# EAGLE design Occulow-Control (EAGLE 8.0.2)

## Sheet 1 of 4
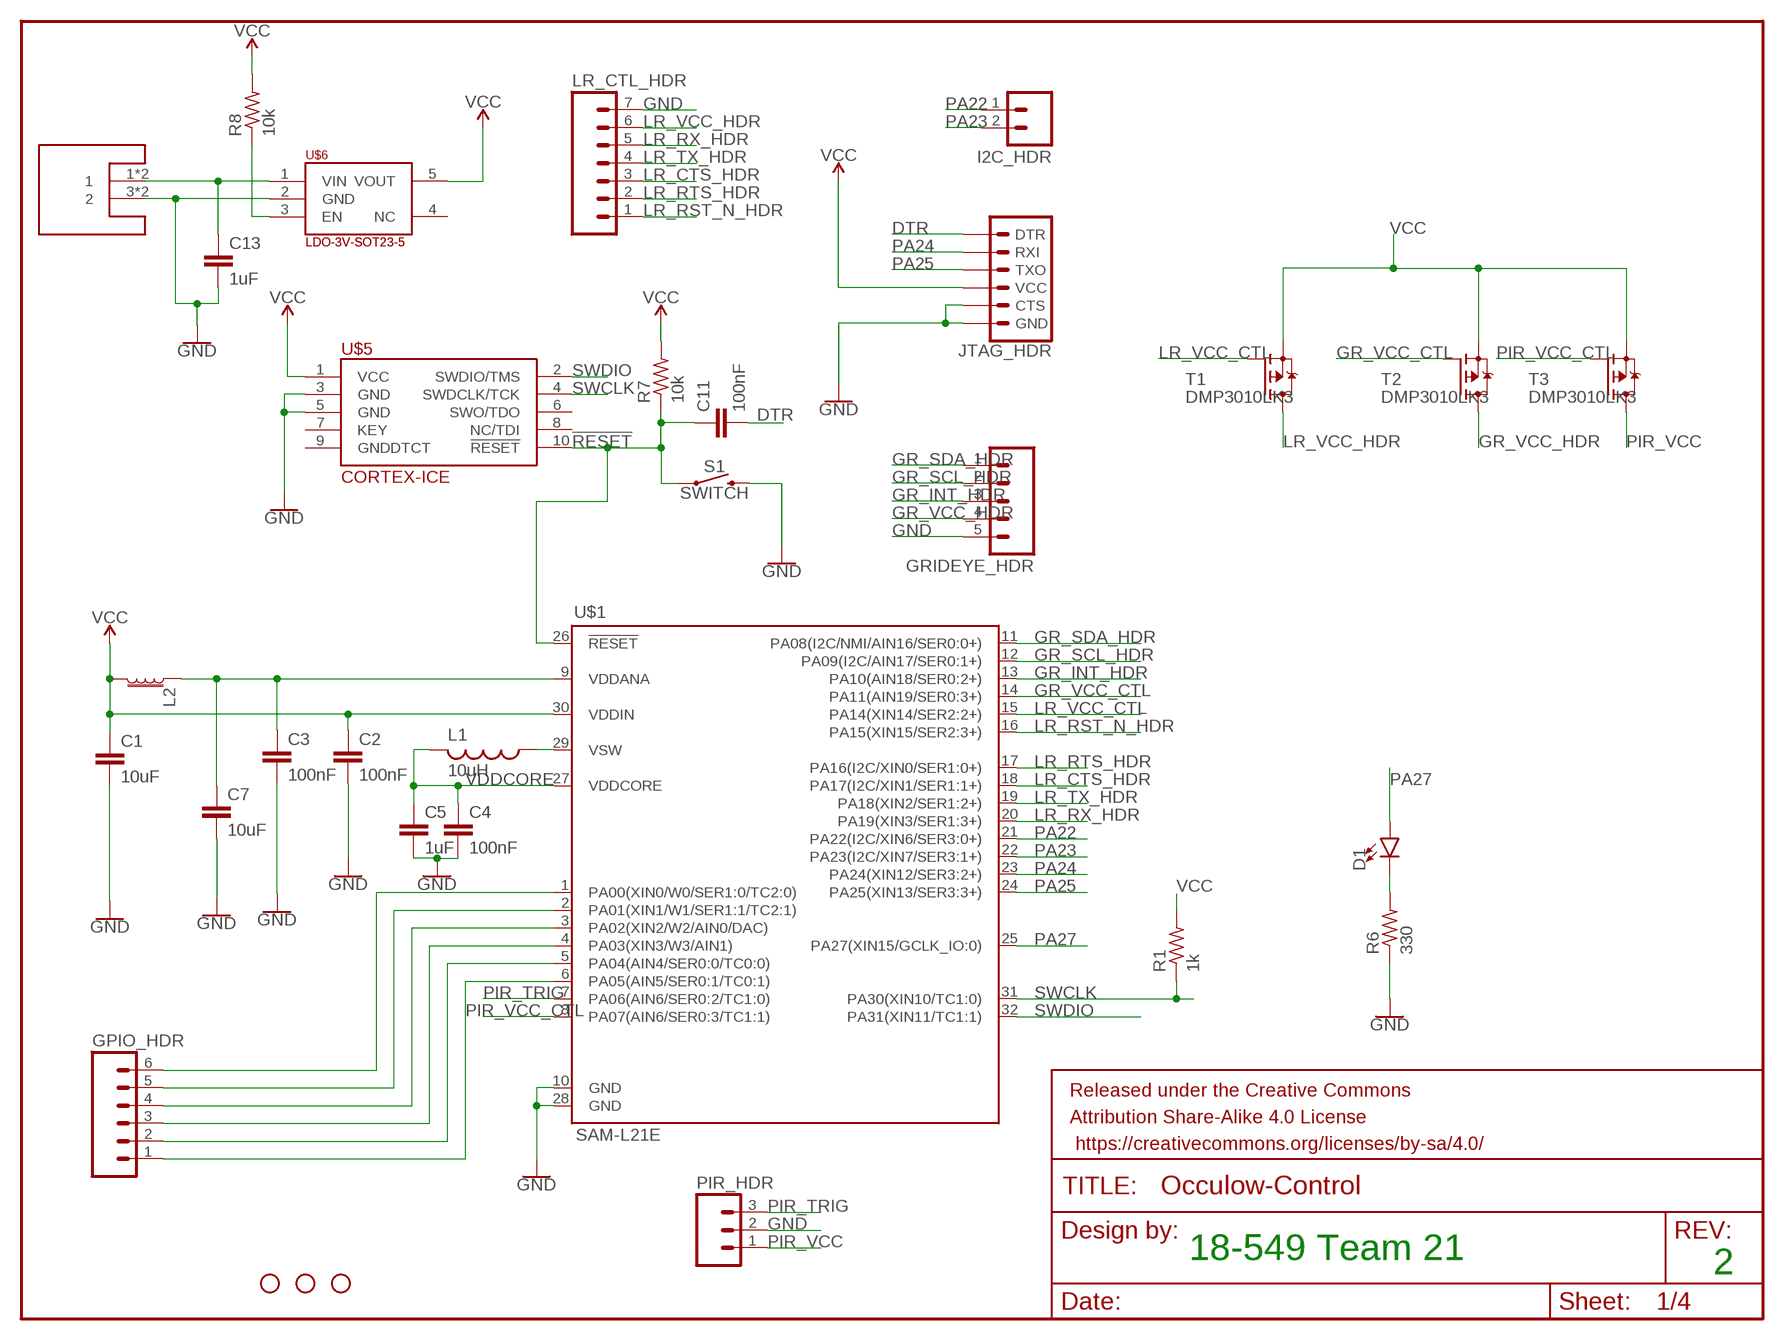
[diagram p0: schematic, sheet 1]

### Parts
C1  10uF  C-EUC1206  [C1206]
C2  100nF  C-EUC1206  [C1206]
C3  100nF  C-EUC1206  [C1206]
C4  100nF  C-EUC1206  [C1206]
C5  1uF  C-EUC1206  [C1206]
C7  10uF  C-EUC1206  [C1206]
C11  100nF  C-EUC1206  [C1206]
C13  1uF  C-EUC1206  [C1206]
D1  LED1206  [LED-1206]
FRAME1  FRAME-LETTERNO_PACKAGE  [DUMMY]
GPIO_HDR  M06  [06P]
GRIDEYE_HDR  M05  [05P]
H1  STAND-OFF  [STAND-OFF]
H2  STAND-OFF  [STAND-OFF]
H3  STAND-OFF  [STAND-OFF]
I2C_HDR  M02  [02P]
JTAG_HDR  6_PIN_SERIAL_TARGET  [1X06]
L1  10uH  L-USL3225M  [L3225M]
L2  FERRITE_BEAD-0603  [0603]
LR_CTL_HDR  M07  [07P]
PIR_HDR  M03  [03P]
R1  1k  R-US_R1206  [R1206]
R6  330  R-US_R1206  [R1206]
R7  10k  R-US_R1206  [R1206]
R8  10k  R-US_R1206  [R1206]
S1  SWITCH  MOMENTARY-SWITCH-SPST-SMD-5.2-REDUNDANT  [TACTILE_SWITCH_SMD_5.2MM]
T1  DMP3010LK3  SPD30P06PTO252  [TO252]
T2  DMP3010LK3  SPD30P06PTO252  [TO252]
T3  DMP3010LK3  SPD30P06PTO252  [TO252]
U$1  SAM-L21E  [TQFP32]
U$5  CORTEX-ICE  [2X5-1.27MM]
U$6  LDO-3V-SOT23-5  [SOT23-5L]
U$7  MINI-LITE-TRAP  [MINI-LITE-TRAP]

### Nets
!RESET: C11.1 R7.1 S1.1 S1.2 U$1.26(!RESET) U$5.10(!RESET)
DTR: C11.2 JTAG_HDR.1(DTR)
GND: C1.2 C2.2 C3.2 C4.2 C5.2 C7.2 C13.2 GRIDEYE_HDR.5 JTAG_HDR.5(CTS) JTAG_HDR.6(GND) LR_CTL_HDR.7 PIR_HDR.2 R6.1 S1.3 S1.4 U$1.10(GND) U$1.28(GND) U$5.3(GND) U$5.5(GND) U$6.2(GND) U$7.3 U$7.4
GR_INT_HDR: GRIDEYE_HDR.3 U$1.13(PA10(AIN18/SER0:2+))
GR_SCL_HDR: GRIDEYE_HDR.2 U$1.12(PA09(I2C/AIN17/SER0:1+))
GR_SDA_HDR: GRIDEYE_HDR.1 U$1.11(PA08(I2C/NMI/AIN16/SER0:0+))
GR_VCC_CTL: T2.1(G) U$1.14(PA11(AIN19/SER0:3+))
GR_VCC_HDR: GRIDEYE_HDR.4 T2.3(D)
LR_CTS_HDR: LR_CTL_HDR.3 U$1.18(PA17(I2C/XIN1/SER1:1+))
LR_RST_N_HDR: LR_CTL_HDR.1 U$1.16(PA15(XIN15/SER2:3+))
LR_RTS_HDR: LR_CTL_HDR.2 U$1.17(PA16(I2C/XIN0/SER1:0+))
LR_RX_HDR: LR_CTL_HDR.5 U$1.20(PA19(XIN3/SER1:3+))
LR_TX_HDR: LR_CTL_HDR.4 U$1.19(PA18(XIN2/SER1:2+))
LR_VCC_CTL: T1.1(G) U$1.15(PA14(XIN14/SER2:2+))
LR_VCC_HDR: LR_CTL_HDR.6 T1.3(D)
N$1: D1.C R6.2
N$5: C13.1 U$6.1(VIN) U$7.1 U$7.2
N$6: R8.1 U$6.3(EN)
PA00: GPIO_HDR.6 U$1.1(PA00(XIN0/W0/SER1:0/TC2:0))
PA01: GPIO_HDR.5 U$1.2(PA01(XIN1/W1/SER1:1/TC2:1))
PA02: GPIO_HDR.4 U$1.3(PA02(XIN2/W2/AIN0/DAC))
PA03: GPIO_HDR.3 U$1.4(PA03(XIN3/W3/AIN1))
PA04: GPIO_HDR.2 U$1.5(PA04(AIN4/SER0:0/TC0:0))
PA05: GPIO_HDR.1 U$1.6(PA05(AIN5/SER0:1/TC0:1))
PA22: I2C_HDR.1 U$1.21(PA22(I2C/XIN6/SER3:0+))
PA23: I2C_HDR.2 U$1.22(PA23(I2C/XIN7/SER3:1+))
PA24: JTAG_HDR.2(RXI) U$1.23(PA24(XIN12/SER3:2+))
PA25: JTAG_HDR.3(TXO) U$1.24(PA25(XIN13/SER3:3+))
PA27: D1.A U$1.25(PA27(XIN15/GCLK_IO:0))
PIR_TRIG: PIR_HDR.3 U$1.7(PA06(AIN6/SER0:2/TC1:0))
PIR_VCC: PIR_HDR.1 T3.3(D)
PIR_VCC_CTL: T3.1(G) U$1.8(PA07(AIN6/SER0:3/TC1:1))
SWCLK: R1.1 U$1.31(PA30(XIN10/TC1:0)) U$5.4(SWDCLK/TCK)
SWDIO: U$1.32(PA31(XIN11/TC1:1)) U$5.2(SWDIO/TMS)
VCC: C1.1 C2.1 JTAG_HDR.4(VCC) L2.2 R1.2 R7.2 R8.2 T1.2(S) T2.2(S) T3.2(S) U$1.30(VDDIN) U$5.1(VCC) U$6.5(VOUT)
VDDANA: C3.1 C7.1 L2.1 U$1.9(VDDANA)
VDDCORE: C4.1 C5.1 L1.2 U$1.27(VDDCORE)
VSW: L1.1 U$1.29(VSW)
Unconnected: U$5.6(SWO/TDO) U$5.7(KEY) U$5.8(NC/TDI) U$5.9(GNDDTCT) U$6.4(NC)

### Notes on the sheet
- 18-549 Team 21
- 2

## Sheet 2 of 4
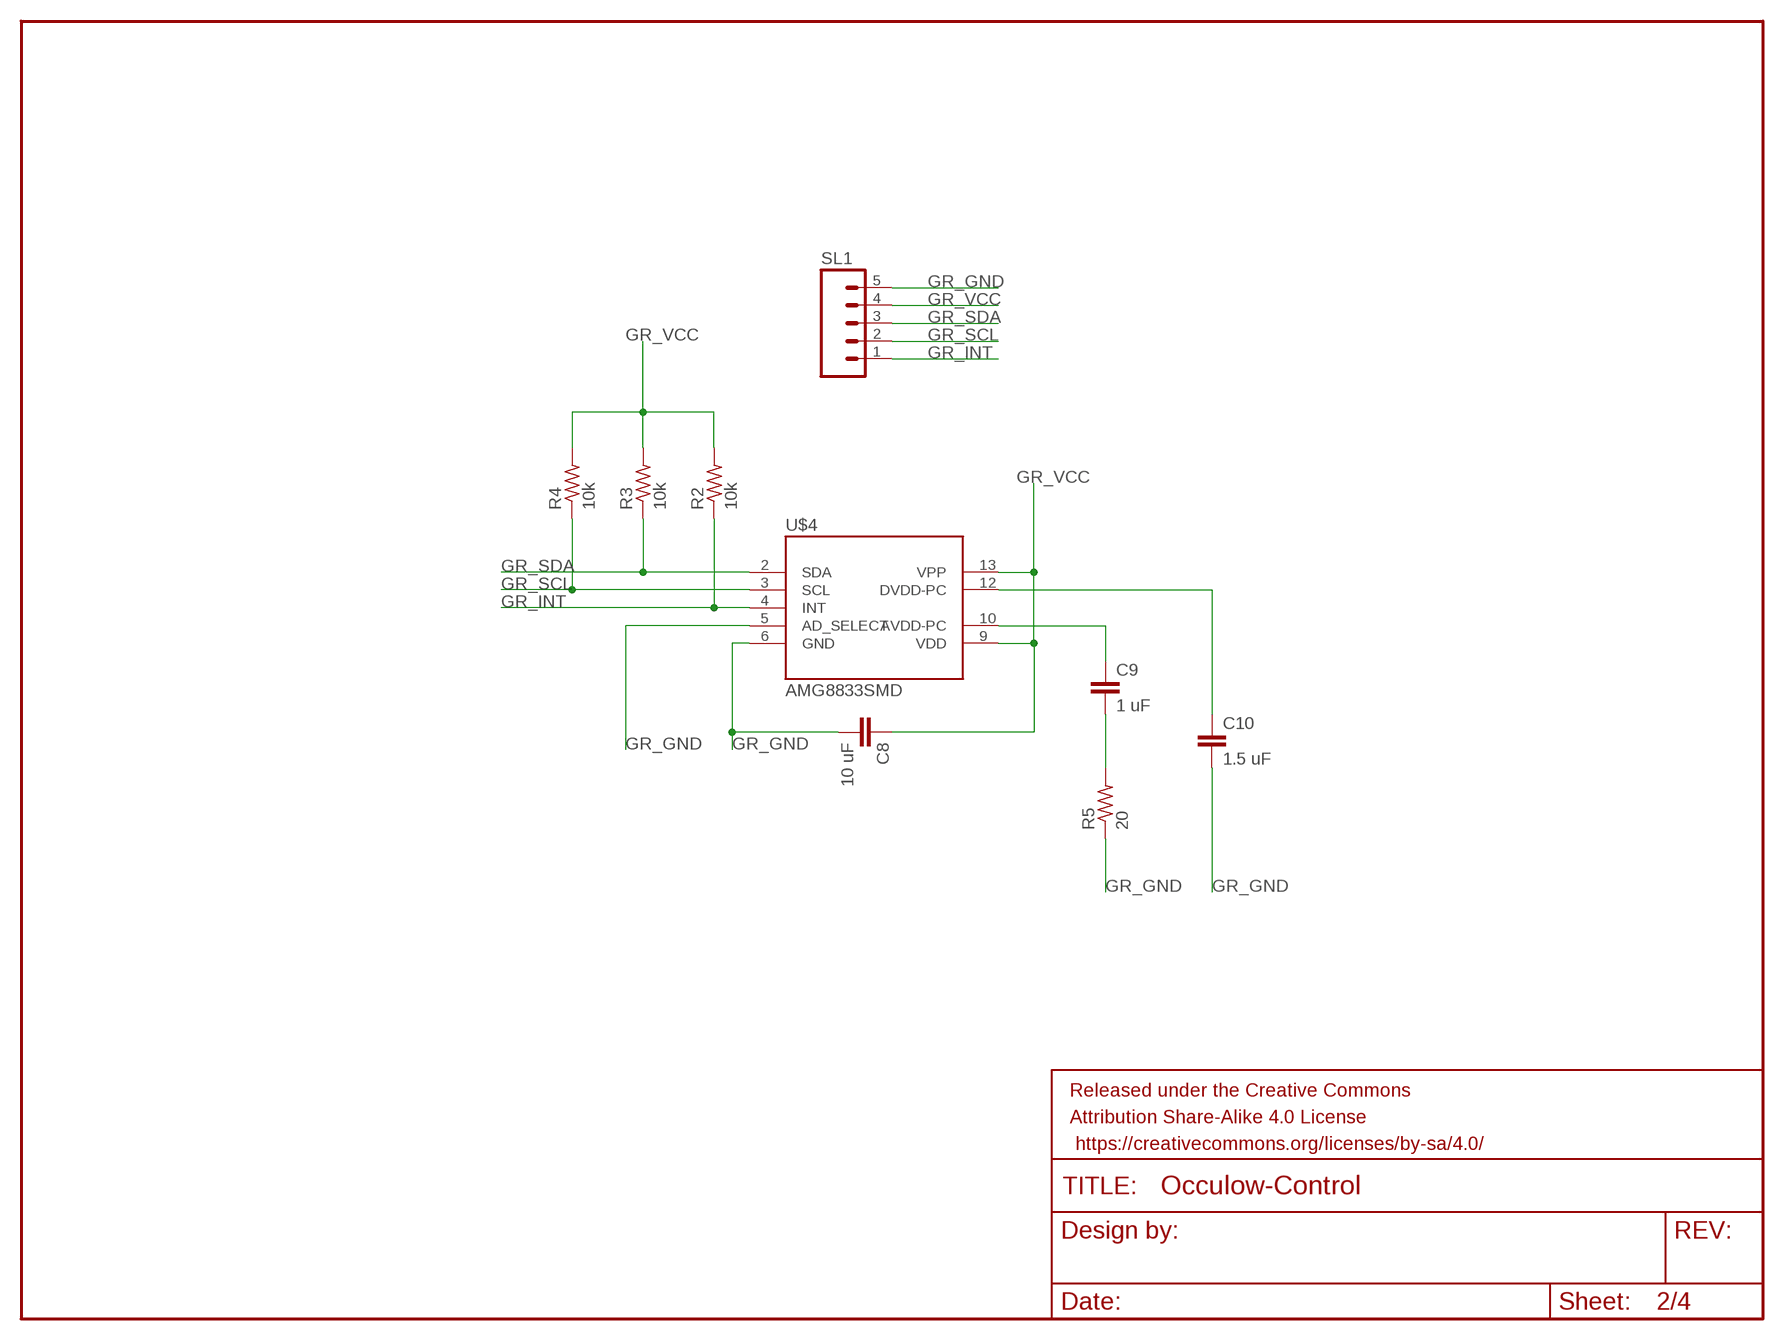
[diagram p1: schematic, sheet 2]

### Parts
C8  10 uF  C-EUC1206  [C1206]
C9  1 uF  C-EUC1206  [C1206]
C10  1.5 uF  C-EUC1206  [C1206]
FRAME2  FRAME-LETTERNO_PACKAGE  [DUMMY]
R2  10k  R-US_R1206  [R1206]
R3  10k  R-US_R1206  [R1206]
R4  10k  R-US_R1206  [R1206]
R5  20  R-US_R1206  [R1206]
SL1  M05  [05P]
U$4  AMG8833SMD  [AMG8833]

### Nets
GR_GND: C8.2 C10.2 R5.1 SL1.5 U$4.5(AD_SELECT) U$4.6(GND)
GR_INT: R2.1 SL1.1 U$4.4(INT)
GR_SCL: R4.1 SL1.2 U$4.3(SCL)
GR_SDA: R3.1 SL1.3 U$4.2(SDA)
GR_VCC: C8.1 R2.2 R3.2 R4.2 SL1.4 U$4.9(VDD) U$4.13(VPP)
N$2: C9.1 U$4.10(AVDD-PC)
N$3: C9.2 R5.2
N$4: C10.1 U$4.12(DVDD-PC)

## Sheet 3 of 4
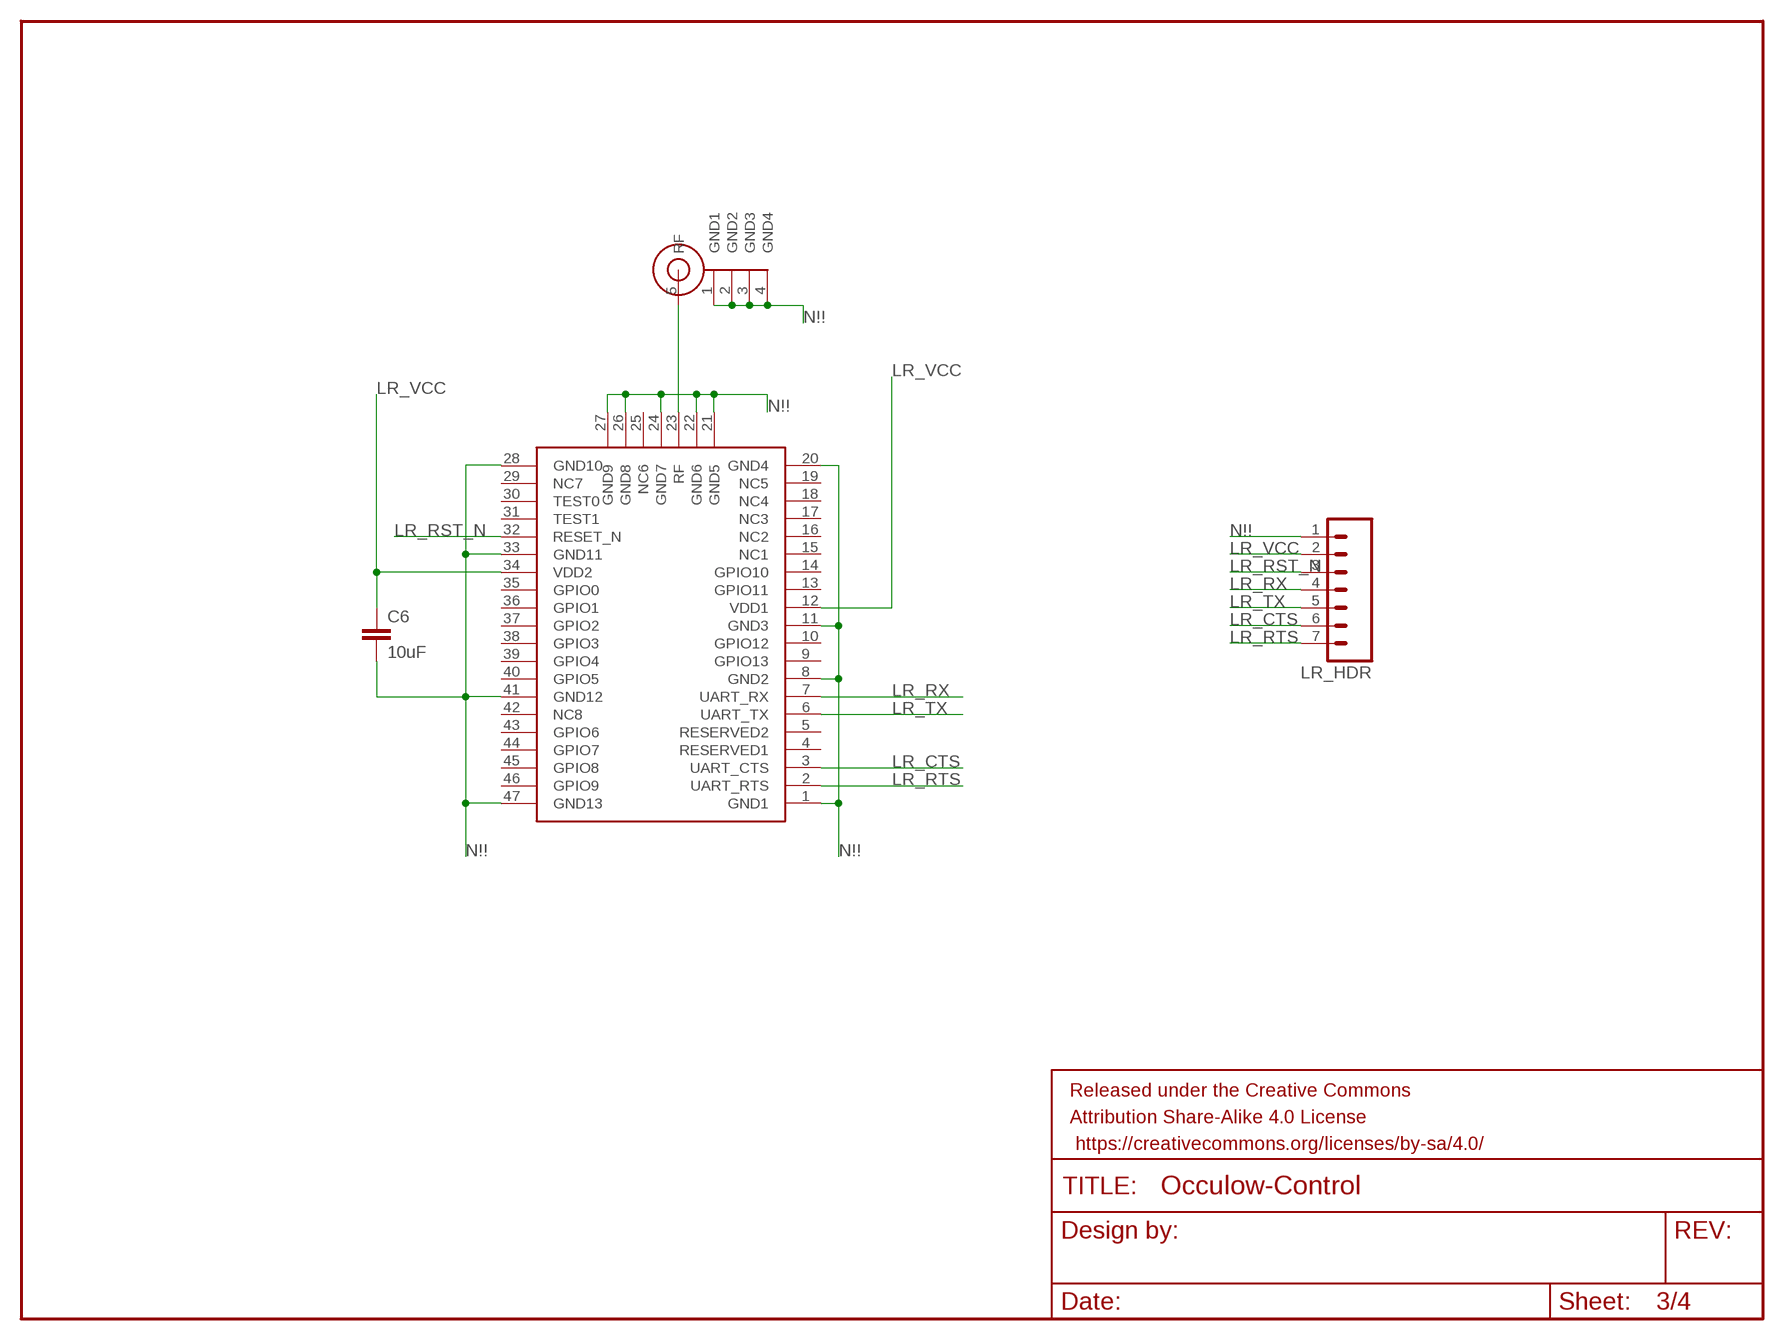
[diagram p2: schematic, sheet 3]

### Parts
C6  10uF  C-EUC1206  [C1206]
FRAME3  FRAME-LETTERNO_PACKAGE  [DUMMY]
LR_HDR  M07  [07P]
U$2  RN2903  [RN2903]
U$3  SMA-JACKFEMALE  [SMA-JACK]

### Nets
LR_CTS: LR_HDR.6 U$2.3(UART_CTS)
LR_RST_N: LR_HDR.3 U$2.32(RESET_N)
LR_RTS: LR_HDR.7 U$2.2(UART_RTS)
LR_RX: LR_HDR.4 U$2.7(UART_RX)
LR_TX: LR_HDR.5 U$2.6(UART_TX)
LR_VCC: C6.1 LR_HDR.2 U$2.12(VDD1) U$2.34(VDD2)
N!!: C6.2 LR_HDR.1 U$2.1(GND1) U$2.8(GND2) U$2.11(GND3) U$2.20(GND4) U$2.21(GND5) U$2.22(GND6) U$2.24(GND7) U$2.26(GND8) U$2.27(GND9) U$2.28(GND10) U$2.33(GND11) U$2.41(GND12) U$2.47(GND13) U$3.1(GND1) U$3.2(GND2) U$3.3(GND3) U$3.4(GND4)
RF: U$2.23(RF) U$3.5(RF)
Unconnected: U$2.4(RESERVED1) U$2.5(RESERVED2) U$2.9(GPIO13) U$2.10(GPIO12) U$2.13(GPIO11) U$2.14(GPIO10) U$2.15(NC1) U$2.16(NC2) U$2.17(NC3) U$2.18(NC4) U$2.19(NC5) U$2.25(NC6) U$2.29(NC7) U$2.30(TEST0) U$2.31(TEST1) U$2.35(GPIO0) U$2.36(GPIO1) U$2.37(GPIO2) U$2.38(GPIO3) U$2.39(GPIO4) U$2.40(GPIO5) U$2.42(NC8) U$2.43(GPIO6) U$2.44(GPIO7) U$2.45(GPIO8) U$2.46(GPIO9)

## Sheet 4 of 4

## Library data of the parts
C1-C11 C13 = rcl:C-EU: CAPACITOR, European symbol
D1 = SparkFun-LED:LED: LED (Generic) Standard schematic elements and footprints for 5mm, 3mm, 1206, and 0603 sized LEDs. Generic LEDs with no color specified.
FRAME1-FRAME3 = SparkFun-Aesthetics:FRAME-LETTER: Schematic Frame - Letter Standard 8.5x11 US Letter frame; DESIGNER: Nobody; VERSION: v01
GPIO_HDR = con-amp-quick:M06: AMP QUICK CONNECTOR; OC_FARNELL: unknown; OC_NEWARK: unknown
GRIDEYE_HDR SL1 = con-amp-quick:M05: AMP QUICK CONNECTOR; OC_FARNELL: unknown; OC_NEWARK: unknown
H1-H3 = SparkFun-Hardware:STAND-OFF: Stand Off Drill holes for mechanically mounting via screws, standoffs, etc. Note: Use the keepout ring to avoid running the screw head into surrounding components. Variant Overviews STAND-OFF - Mechanical footprint for a #4 phillips button head screw. STAND-OFF-TIGHT - Mechanical footprint for a #4 phillips button head screw, Example SparkFun Products Screw - Phillips Head (1/4", 4-40, 10 pack) <https://www.sparkfun.com/products/10453> (PRT-10453) Screw - Phillips Head (1/2", 4-40, 10 pack) <https://www.sparkfun.com/products/10452> (PRT-10452) Screw - Phillips Head (3/4", 4-40, 10 pack) <https://www.sparkfun.com/products/10451> (PRT-10451) Screw - Phillips Head (1", 4-40, 10 pack) <https://www.sparkfun.com/products/10450> (PRT-10450)
I2C_HDR = con-amp-quick:M02: AMP QUICK CONNECTOR; OC_FARNELL: unknown; OC_NEWARK: unknown
JTAG_HDR = SparkFun-Connectors:6_PIN_SERIAL_TARGET: 6-pin header connection for use with the "FTDI BASIC" pinout - TARGET SIDE. Also known as "Arduino Serial Program Header". It is used to mate with our FTDI Basic serial programmers using the Arduino IDE. Note, this device has "TARGET" in the name. It is intended to be used on a design that contains a target micro-controller that you wish to program. The "sister" device, named "CABLE" is inteneded to be used on a design that usually lives on the end of your USB cable and prvides the converter chip (FTDI232 or FTDI231x) to commnicate serial RX/TX. You can populate with some of these: Break Away Headers - Straight <https://www.sparkfun.com/products/116> (PRT-00116) For reference (or to suit your programming needs) check out these designs: SparkFun FTDI Basic Breakout - 5V <https://www.sparkfun.com/products/9716> (DEV-09716) SparkFun FTDI Basic Breakout - 3.3V <https://www.sparkfun.com/products/9873> (DEV-09873) SparkFun FTDI SmartBasic <https://www.sparkfun.com/products/12935> (DEV-12935) SparkFun Beefy 3 - FTDI Basic Breakout <https://www.sparkfun.com/products/13746> (DEV-13746)
L1 = resistor:L-US: INDUCTOR, American symbol
L2 = SparkFun-Coils:FERRITE_BEAD: Ferrite Bead (blocks, cores, rings, chokes, etc.) Inductor with layers of ferrite used to suppress high frequencies. Often used to isolate high frequency noise. SparkFun Products: IOIO-OTG - V2.2 <https://www.sparkfun.com/products/13613> SparkFun SAMD21 Mini Breakout <https://www.sparkfun.com/products/13664> SparkFun 6 Degrees of Freedom Breakout - LSM6DS3 <https://www.sparkfun.com/products/13339> SparkFun SAMD21 Dev Breakout <https://www.sparkfun.com/products/13672>; PROD_ID: NDUC-07859; VALUE: 30Ω/1.8A
LR_CTL_HDR LR_HDR = con-amp-quick:M07: AMP QUICK CONNECTOR; OC_FARNELL: unknown; OC_NEWARK: unknown
PIR_HDR = con-amp-quick:M03: AMP QUICK CONNECTOR; OC_FARNELL: unknown; OC_NEWARK: unknown
R1-R8 = resistor:R-US_: RESISTOR, American symbol
S1 = SparkFun-Switches:MOMENTARY-SWITCH-SPST: Momentary Switch (Pushbutton) - SPST Normally-open (NO) SPST momentary switches (buttons, pushbuttons). Variants PTH-12MM - 12mm square, through-hole Momentary Pushbutton Switch - 12mm Square <https://www.sparkfun.com/products/9190> (COM-09190) PTH-6.0MM, PTH-6.0MM-KIT - 6.0mm square, through-hole Mini Pushbutton Switch <https://www.sparkfun.com/products/97> (COM-00097) KIT package intended for soldering kit's - only one side of pads' copper is exposed. PTH-RIGHT-ANGLE-KIT - Right-angle, through-hole Right Angle Tactile Button <https://www.sparkfun.com/products/10791> - Used on SparkFun BigTime Watch Kit <https://www.sparkfun.com/products/11734> SMD-12MM - 12mm square, surface-mount Tactile Button - SMD (12mm) <https://www.sparkfun.com/products/12993> (COM-12993) Used on SparkFun PicoBoard <https://www.sparkfun.com/products/11888> SMD-4.5MM - 4.5mm Square Trackball Switch Used on SparkFun Blackberry Trackballer Breakout <https://www.sparkfun.com/products/13169> SMD-4.6MMX2.8MM - 4.60mm x 2.80mm, surface mount Used on SparkFun SAMD21 Mini Breakout <https://www.sparkfun.com/products/13664> SMD-5.2MM, SMD-5.2-REDUNDANT - 5.2mm square, surface-mount Mini Pushbutton Switch - SMD <https://www.sparkfun.com/products/8720> (COM-08720) Used on Arduino Pro Mini <https://www.sparkfun.com/products/11114> REDUNDANT package connects both switch circuits together SMD-6.0X3.5MM - 6.0 x 3.5mm, surface mount Momentary Reset Switch SMD <https://www.sparkfun.com/products/8229> (COM-08229) SMD-6.2MM-TALL - 6.2mm square, surface mount Tactile Button - SMD (6mm) <https://www.sparkfun.com/products/12992> Used on SparkFun Digital Sandbox <https://www.sparkfun.com/products/12651> SMD-RIGHT-ANGLE - Right-angle, surface mount Used on SparkFun Block for Intel® Edison - Arduino <https://www.sparkfun.com/products/13036>; PROD_ID: SWCH-08247; SF_SKU: COM-08720
T1-T3 = transistor-fet:SPD30P06P: SIPMOS(R) Power-Transistor P-Channel, Enhancement mode Source: http://www.infineon.com/upload/Document/cmc_upload/documents/012/3615/SPD_U30P06P.pdf
U$1 = SAML21-TQFP32:SAM-L21E: SAM L21E Microcontroller
U$2 = RN2903:RN2903
U$3 = SMA-JACK:SMA-JACK: Female SMA through-hole jack. http://www.te.com/commerce/DocumentDelivery/DDEController?Action=srchrtrv&DocNm=1814832&DocType=Customer+Drawing&DocLang=English http://www.digikey.com/product-detail/en/te-connectivity-amp-connectors/5-1814832-1/A97594-ND/1755982
U$4 = GridEye:AMG8833: AMG8833 Grid-Eye infrared sensor
U$5 = cortex-debug:CORTEX-ICE
U$6 = Occulow:LDO-3V-SOT23-5
U$7 = lite-trap:MINI-LITE-TRAP

## Board
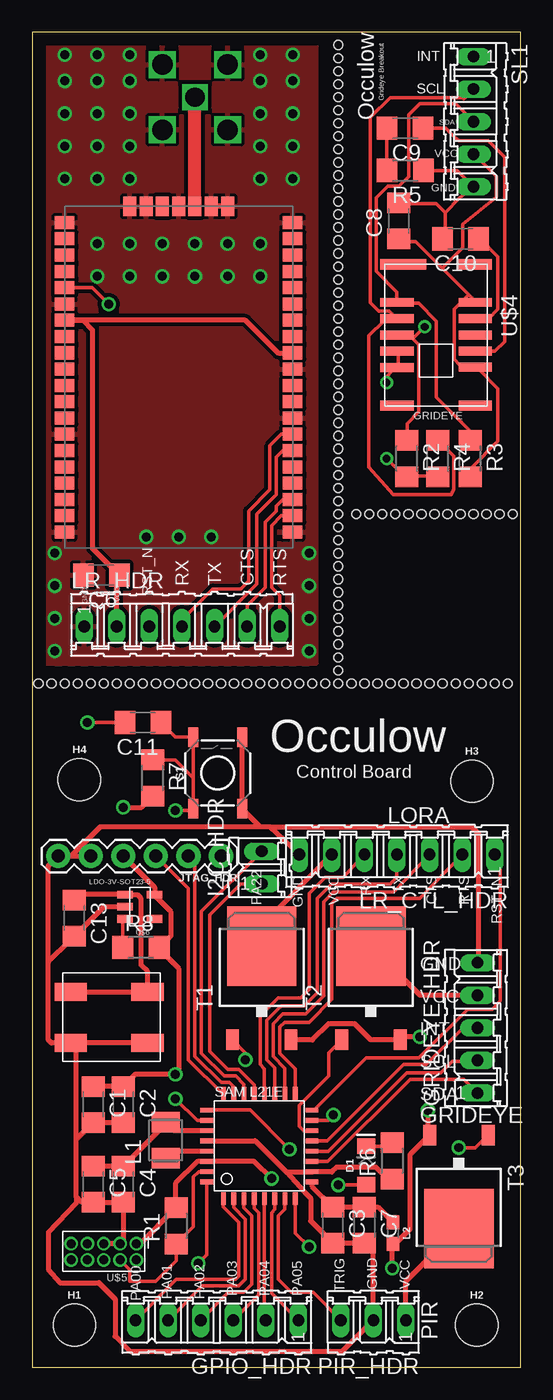
[diagram p3: board, top side]
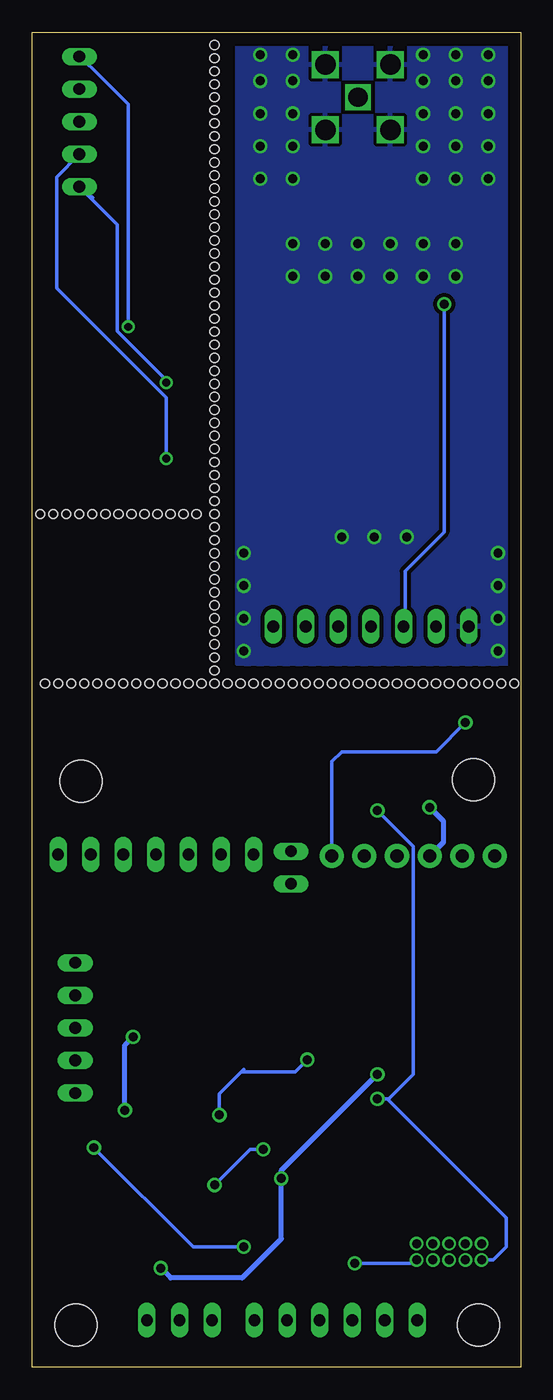
[diagram p4: board, bottom side, seen from below]

Size 38.1 x 104.14 mm. Coordinates in mm from the lower left corner, seen from the top.
Outline: 0,0 38.1,0 38.1,104.14 0,104.14 0,0
Copper layers (1*16): Top 0.035mm / dielectric 1.5mm / Bottom 0.035mm
Design rules "default *": minimum track width 10mil, minimum drill 24mil, track to track 8mil, track to pad 8mil, pad to pad 8mil, via to via 8mil, smd to smd 8mil, copper to edge 40mil, drill to drill 8mil, minimum pad ring 5mil, minimum via ring 8mil, stop-mask expansion 4mil, vias tented up to drill 0mil, thermal gap 10mil
Holes 0.7 mm at 0.51,53.34 1.52,53.34 2.54,53.34 3.56,53.34 4.57,53.34 5.59,53.34 6.6,53.34 7.62,53.34 8.64,53.34 9.65,53.34 10.67,53.34 11.68,53.34 12.7,53.34 13.72,53.34 14.73,53.34 15.75,53.34 16.76,53.34 17.78,53.34 18.8,53.34 19.81,53.34 20.83,53.34 21.84,53.34 22.86,53.34 23.88,53.34 24.89,53.34 25.91,53.34 26.92,53.34 27.94,53.34 28.96,53.34 29.97,53.34 30.99,53.34 32,53.34 33.02,53.34 34.04,53.34 35.05,53.34 36.07,53.34 37.08,53.34 23.88,78.74 23.88,79.76 23.88,80.77 23.88,81.79 23.88,82.8 23.88,83.82 23.88,84.84 23.88,85.85 23.88,86.87 23.88,87.88 23.88,88.9 23.88,89.92 23.88,90.93 23.88,91.95 23.88,92.96 23.88,93.98 23.88,95 23.88,96.01 23.88,97.03 23.88,98.04 23.88,99.06 23.88,100.08 23.88,101.09 23.88,102.11 23.88,103.12 23.88,77.72 23.88,76.71 23.88,75.69 23.88,74.68 23.88,73.66 23.88,72.64 23.88,71.63 23.88,70.61 23.88,69.6 23.88,68.58 23.88,67.56 23.88,66.55 23.88,65.53 23.88,64.52 23.88,63.5 23.88,62.48 23.88,61.47 23.88,60.45 23.88,59.44 23.88,58.42 23.88,57.4 23.88,56.39 23.88,55.37 23.88,54.36 25.27,66.55 26.29,66.55 27.3,66.55 28.32,66.55 29.34,66.55 30.35,66.55 31.37,66.55 32.38,66.55 33.4,66.55 34.42,66.55 35.43,66.55 36.45,66.55 37.47,66.55

### Footprints (pad centres in the part's own frame; a part is rotated, then mirrored left to right if it is on the bottom)
C1206 = smd 1.6 x 1.8: 1 -1.4,0; 2 1.4,0
LED-1206 = smd 1.2 x 1.4: A -1.5,0; C 1.5,0
06P = drill 0.914 long: 1 -6.35,0; 2 -3.81,0; 3 -1.27,0; 4 1.27,0; 5 3.81,0; 6 6.35,0
05P = drill 0.914 long: 1 -5.08,0; 2 -2.54,0; 3 0,0; 4 2.54,0; 5 5.08,0
STAND-OFF = hole 3.302: 0,0
02P = drill 0.914 long: 1 -1.27,0; 2 1.27,0
1X06 = drill 1.016 pad 1.88: 1 0,0; 2 2.54,0; 3 5.08,0; 4 7.62,0; 5 10.16,0; 6 12.7,0
L3225M = smd 1.6 x 2.2: 1 -1.4,0; 2 1.4,0
0603 = smd 1.1 x 1: 1 -0.85,0; 2 0.85,0
07P = drill 0.914 long: 1 -7.62,0; 2 -5.08,0; 3 -2.54,0; 4 0,0; 5 2.54,0; 6 5.08,0; 7 7.62,0
03P = drill 0.914 long: 1 -2.54,0; 2 0,0; 3 2.54,0
R1206 = smd 1.6 x 1.803: 1 -1.422,0; 2 1.422,0
TACTILE_SWITCH_SMD_5.2MM = smd 1.524 x 0.762: 1 -2.794,1.905; 2 2.794,1.905; 3 -2.794,-1.905; 4 2.794,-1.905
TO252 = smd 1 x 1.6: 1 -2.28,-4.8; 2 2.28,-4.8 | smd 5.4 x 6.2: 3 0,2.5
TQFP32 = smd 1 x 0.37: 1 -4.1,2.8; 2 -4.1,2; 3 -4.1,1.2; 4 -4.1,0.4; 5 -4.1,-0.4; 6 -4.1,-1.2; 7 -4.1,-2; 8 -4.1,-2.8; 17 4.1,-2.8; 18 4.1,-2; 19 4.1,-1.2; 20 4.1,-0.4; 21 4.1,0.4; 22 4.1,1.2; 23 4.1,2; 24 4.1,2.8 | smd 0.37 x 1: 9 -2.8,-4.1; 10 -2,-4.1; 11 -1.2,-4.1; 12 -0.4,-4.1; 13 0.4,-4.1; 14 1.2,-4.1; 15 2,-4.1; 16 2.8,-4.1; 25 2.8,4.1; 26 2,4.1; 27 1.2,4.1; 28 0.4,4.1; 29 -0.4,4.1; 30 -1.2,4.1; 31 -2,4.1; 32 -2.8,4.1
RN2903 = smd 1.524 x 1.016: 1 8.89,-11.43; 2 8.89,-10.16; 3 8.89,-8.89; 4 8.89,-7.62; 5 8.89,-6.35; 6 8.89,-5.08; 7 8.89,-3.81; 8 8.89,-2.54; 9 8.89,-1.27; 10 8.89,0; 11 8.89,1.27; 12 8.89,2.54; 13 8.89,3.81; 14 8.89,5.08; 15 8.89,6.35; 16 8.89,7.62; 17 8.89,8.89; 18 8.89,10.16; 19 8.89,11.43; 20 8.89,12.7; 28 -8.89,12.7; 29 -8.89,11.43; 30 -8.89,10.16; 31 -8.89,8.89; 32 -8.89,7.62; 33 -8.89,6.35; 34 -8.89,5.08; 35 -8.89,3.81; 36 -8.89,2.54; 37 -8.89,1.27; 38 -8.89,0; 39 -8.89,-1.27; 40 -8.89,-2.54; 41 -8.89,-3.81; 42 -8.89,-5.08; 43 -8.89,-6.35; 44 -8.89,-7.62; 45 -8.89,-8.89; 46 -8.89,-10.16; 47 -8.89,-11.43 | smd 1.016 x 1.524: 21 3.81,13.97; 22 2.54,13.97; 23 1.27,13.97; 24 0,13.97; 25 -1.27,13.97; 26 -2.54,13.97; 27 -3.81,13.97
SMA-JACK = drill 1.6 square: 1 -2.54,2.54; 2 2.54,2.54; 3 2.54,-2.54; 4 -2.54,-2.54 | drill 1.5 square: 5 0,0
AMG8833 = smd 0.8 x 3.6: 1 -5.5,-2.55 | smd 0.7 x 2.6: 2 -2.54,-3.05; 3 -1.27,-3.05; 4 0,-3.04; 5 1.27,-3.05; 6 2.54,-3.05; 9 2.52,3.05; 10 1.27,3.05; 11 0,3.05; 12 -1.27,3.05; 13 -2.54,3.05 | smd 0.8 x 2.6: 7 5.5,-3.05; 8 5.5,3.05; 14 -5.5,3.05
2X5-1.27MM = drill 0.7 pad 1.016: 1 -2.54,0; 2 -2.54,1.27; 3 -1.27,0; 4 -1.27,1.27; 5 0,0; 6 0,1.27; 7 1.27,0; 8 1.27,1.27; 9 2.54,0; 10 2.54,1.27
SOT23-5L = smd 1.2 x 0.6: 1 -1.15,0.95; 2 -1.15,0; 3 -1.15,-0.95; 4 1.15,-0.95; 5 1.15,0.95
MINI-LITE-TRAP = smd 2.5 x 1.4: 1 -3,1.5; 2 3,1.5; 3 -3,-2.5; 4 3,-2.5

### Placement (x,y rotation side)
C1  4.76,20.51 270 top
C2  7.11,20.51 270 top
C3  23.43,11.11 270 top
C4  7.11,14.29 270 top
C5  4.76,14.29 270 top
C6  5.4,61.79 180 top
C7  25.91,11.11 270 top
C8  28.57,89.41 90 top
C9  29.08,96.65 180 top
C10  33.4,88.01 180 top
C11  8.64,50.29 180 top
C13  3.3,35.05 270 top
D1  26.04,15.75 90 top
FRAME1  19.05,44.45 0 top
FRAME2  -3.81,-3.81 0 top  (outside the outline)
FRAME3  -3.81,-5.08 0 top  (outside the outline)
GPIO_HDR  14.41,3.68 180 top
GRIDEYE_HDR  34.73,26.48 90 top
H1  3.3,3.3 0 top
H2  34.67,3.3 0 top
H3  34.29,45.72 0 top
H4  STAND-OFF  [STAND-OFF]  3.68,45.85 0 top
I2C_HDR  17.91,38.99 90 top
JTAG_HDR  14.73,39.88 180 top
L1  10.41,17.72 90 top
L2  28.13,10.48 270 top
LR_CTL_HDR  28.45,40.01 180 top
LR_HDR  11.68,57.78 0 top
PIR_HDR  26.61,3.68 180 top
R1  11.24,11.05 90 top
R2  29.21,70.87 270 top
R3  34.16,70.87 270 top
R4  31.62,70.87 270 top
R5  29.08,93.34 180 top
R6  28.07,16.13 90 top
R7  9.4,45.97 270 top
R8  8.49,32.74 0 top
S1  14.48,46.35 90 top
SL1  34.42,97.16 270 top
T1  17.91,30.35 0 top
T2  26.42,30.35 0 top
T3  33.27,13.34 180 top
U$1  17.72,17.27 90 top
U$2  11.43,76.58 0 top
U$3  12.7,99.06 0 top
U$4  31.5,80.52 270 top
U$5  5.59,9.65 180 top
U$6  8.4,35.92 0 top
U$7  6,27.8 0 top

### Tracks (layer width: path | path; a pad name or v marks a point on that pad's centre or on a via)
!RESET  (via drill 0.7)
  Top 0.254: U$1.26 12.86,19.27 v11.18,20.95 | 12.57,45.97 S1.2 11.18,49.15 C11.1 | 12.57,45.97 S1.1 12.45,43.43 v11.18,43.43 | 12.57,45.97 11.18,47.37 9.42,47.37 R7.1
  Bottom 0.254: U$5.10 2.16,8.38 1.14,9.4 1.14,11.68 10.41,20.95 v11.18,20.95 10.29,20.95 8.38,22.86 8.38,40.64 v11.18,43.43
DTR  (via drill 0.7)
  Top 0.254: v4.32,50.29 C11.2
  Bottom 0.254: JTAG_HDR.1 14.73,47.24 13.97,48.01 6.6,48.01 v4.32,50.29
GND
  Top 0.406: U$1.28 17.38,17.67 19.81,15.24 | 19.81,15.24 21.79,15.24 U$1.10 21.85,15.24 23.37,15.24 23.75,15.62 26.8,15.62 27.71,14.71 R6.1 | 19.81,15.24 21.26,13.67 | 21.26,13.67 21.34,13.59 | 21.26,13.67 21.26,13.66 21.72,13.21 21.72,11.43 C3.2 C7.2 26.61,9.01 PIR_HDR.2 24.19,1.27 7.62,1.27 6.48,2.41 6.48,5.33 5.21,6.6 2.16,6.6 1.27,7.62 1.27,10.54 3.43,12.83 3.43,13.34 | C5.2 C4.2 7.11,9.91 U$5.3 U$5.5 | 4.95,12.7 C5.2 | C2.2 C1.2 3.43,17.78 | C5.2 3.88,12.89 3.43,13.34 | 3.43,13.34 3.43,17.78 | 3.43,17.78 3.43,24.87 U$7.3 | LR_CTL_HDR.7 18.54,42.16 | 18.54,42.16 34.29,42.16 34.8,41.66 34.8,31.62 GRIDEYE_HDR.5 | 18.54,42.16 17.78,42.16 | 17.78,42.16 S1.3 S1.4 | 3.05,39.88 JTAG_HDR.5 | 3.05,39.88 JTAG_HDR.6 1.27,39.12 1.27,31.62 | 3.05,39.88 5.33,42.16 17.78,42.16 | U$7.4 U$7.3 | U$7.3 1.5,25.3 1.27,25.53 1.27,31.62 | 2.92,33.27 1.27,31.62 | 2.92,33.27 C13.2 | U$6.2 5.58,35.92 2.92,33.27
GR_GND  (via drill 0.61)
  Top 0.254: 32.21,90.07 32.21,88.01 C10.2 | 32.21,90.07 33.35,91.21 SL1.5 33.15,93.34 R5.1 | 32.21,90.07 31.52,90.75 28.78,90.75 C8.2 | U$4.5 28.55,79.1 28.55,78.18 U$4.6 28.32,77.95 27.41,77.04 v27.64,76.81
  Bottom 0.254: 33.35,91.21 SL1.5 31.45,89.1 31.45,80.81 27.64,77 v27.64,76.81
GR_INT  (via drill 0.61)
  Top 0.254: 29.69,80.24 29.46,80.47 28.55,80.47 U$4.4 29.69,80.24 | 29.69,80.24 30.15,79.78 30.15,74.52 29.23,73.61 29.23,72.47 R2.1 | 29.69,80.24 v30.61,81.15
  Bottom 0.254: v30.61,81.15 30.61,98.53 33.35,101.27 SL1.1
GR_INT_HDR
  Top 0.254: U$1.13 23.01,17.67 28.96,23.62 30.73,23.62 33.53,26.42 34.67,26.42 GRIDEYE_HDR.3
GR_SCL
  Top 0.254: 27.41,81.61 26.26,80.47 26.26,70.22 28.17,68.06 32.66,68.06 32.85,68.51 32.85,71.06 R4.1 | 27.41,81.61 28.32,81.61 U$4.3 | 27.41,81.61 U$4.3 | 33.66,98.93 SL1.2 33.76,99.03 27.9,99.03 26.36,97.49 26.36,83.03 27.01,82.38 27.86,82.38 U$4.3
GR_SCL_HDR
  Top 0.254: U$1.12 23.09,16.87 29.21,22.99 31.88,22.99 32.77,23.88 34.67,23.88 GRIDEYE_HDR.2
GR_SDA
  Top 0.254: R3.1 34.04,72.47 34.04,73.15 31.52,75.67 31.52,81.61 30.15,82.98 28.55,82.98 U$4.2 | 28.32,83.21 U$4.2 | SL1.3 32.99,98.58 32.97,98.55 30.23,98.55 29.55,97.88 29.35,97.68 29.35,92.87 28.6,92.11 27.71,92.11 26.82,91.22 26.82,85.48 28.45,83.85 U$4.2
GR_SDA_HDR
  Top 0.254: U$1.11 23.06,16.07 29.46,22.48 33.66,22.48 GRIDEYE_HDR.1
GR_VCC  (via drill 0.61)
  Top 0.254: R3.2 34.27,69.49 34.27,70.18 36.32,72.24 36.32,76.35 34.72,77.95 U$4.9 34.49,78.18 33.35,78.18 32.89,78.64 32.89,82.53 34.04,83.67 | 34.04,83.67 34.49,83.21 U$4.13 | 34.04,83.67 31.98,85.72 | 31.98,85.72 29.92,87.78 28.78,87.78 C8.1 | R4.2 31.52,69.49 29.23,69.49 R2.2 29.01,69.49 v27.64,70.87 | 31.98,85.72 33.58,87.33 33.58,89.15 36.2,91.26 36.2,92.89 35.61,93.47 SL1.4
  Bottom 0.254: 34.85,94.23 SL1.4 36.2,92.84 36.2,92.71 36.17,92.69 36.17,84.16 27.64,75.62 v27.64,70.87
GR_VCC_CTL
  Top 0.254: T2.1 23.11,24.53 23.11,22.73 20.83,20.45 20.83,18.8 21.21,18.41 21.76,18.41 U$1.14
GR_VCC_HDR
  Top 0.406: GRIDEYE_HDR.4 30.25,29.02 T2.3
LR_CTS
  Top 0.254: LR_HDR.6 16.76,59.44 18.16,60.83 18.16,65.91 19.05,66.8 19.05,67.18 19.56,67.69 U$2.3
LR_CTS_HDR
  Top 0.254: U$1.18 19.72,23.34 18.8,24.26 18.8,26.8 19.56,27.56 21.34,27.56 22.73,28.96 22.73,36.32 23.5,37.08 28.19,37.08 LR_CTL_HDR.3
LR_RST_N  (via drill 0.7)
  Top 0.254: U$2.32 4.7,84.2 v5.97,82.93
  Bottom 0.254: v5.97,82.93 5.97,65.15 9.02,62.1 9.02,57.91 LR_HDR.3
LR_RST_N_HDR
  Top 0.254: 36.58,39.32 36.12,39.78 LR_CTL_HDR.1 36.51,39.37 36.51,28.57 35.88,27.94 33.97,27.94 30.16,24.13 26.04,24.13 21.91,20 U$1.16 21.95,20.12
LR_RTS
  Top 0.254: LR_HDR.7 19.3,60.2 18.67,60.83 18.67,65.66 19.43,66.42 U$2.2
LR_RTS_HDR
  Top 0.254: U$1.17 20.52,23.3 19.3,24.51 19.3,26.54 19.68,26.92 21.59,26.92 23.37,28.7 23.37,36.2 23.75,36.58 30.23,36.58 LR_CTL_HDR.2
LR_RX
  Top 0.254: LR_HDR.4 11.68,58.29 14.1,60.71 16.26,60.71 16.89,61.34 16.89,66.8 18.54,68.45 18.54,71.88 19.43,72.77 U$2.7
LR_RX_HDR
  Top 0.254: U$1.20 18.12,23.29 17.78,23.62 17.78,27.43 19.18,28.83 20.95,28.83 21.59,29.46 21.59,36.96 22.86,38.23 24.26,38.23 LR_CTL_HDR.5
LR_TX
  Top 0.254: LR_HDR.5 17.53,61.09 17.53,66.55 19.05,68.07 19.05,70.99 19.56,71.5 U$2.6
LR_TX_HDR
  Top 0.254: U$1.19 18.92,23.38 18.29,24 18.29,27.05 19.43,28.19 21.21,28.19 22.23,29.21 22.23,36.58 23.37,37.72 27.94,37.72 28.45,38.23 LR_CTL_HDR.4
LR_VCC
  Top 0.406: U$2.12 19.18,79.12 16.64,81.66 U$2.34 3.94,81.66 4.7,80.9 4.7,63.88 C6.1 6.6,61.59 LR_HDR.2
LR_VCC_CTL  (via drill 0.7)
  Top 0.254: U$1.15 23.08,19.27 v23.5,19.68 | v16.64,24 16.64,24.54 T1.1
  Bottom 0.254: v23.5,19.68 23.5,21.34 21.78,23.05 | 21.78,23.05 21.59,23.24 | 21.78,23.05 17.59,23.05 v16.64,24
LR_VCC_HDR
  Top 0.406: T1.3 17.91,34.42 LR_CTL_HDR.6
N!!  (via drill 0.7)
  Top 0.406: 4.06,61.72 C6.2 | U$2.21 U$2.22
  other vias: 2.54,102.36 7.62,102.36 5.08,102.36 17.78,102.36 20.32,102.36 20.32,100.33 17.78,100.33 7.62,100.33 5.08,100.33 2.54,100.33 2.54,97.79 5.08,97.79 7.62,97.79 17.78,97.79 20.32,97.79 20.32,95.25 17.78,95.25 17.78,92.71 20.32,92.71 7.62,95.25 5.08,95.25 2.54,95.25 2.54,92.71 5.08,92.71 7.62,92.71 5.08,87.63 7.62,87.63 10.16,87.63 12.7,87.63 15.24,87.63 17.78,87.63 17.78,85.09 15.24,85.09 12.7,85.09 10.16,85.09 7.62,85.09 5.08,85.09 1.78,63.5 1.78,60.96 1.78,58.42 1.78,55.88 21.59,63.5 21.59,60.96 21.59,58.42 21.59,55.88 8.89,64.77 11.43,64.77 13.97,64.77
  pour Top (isolate 0.305): 0.76,103.38 22.1,103.38 22.1,54.86 0.76,54.86
  pour Bottom (isolate 0.305): 0.76,103.38 22.1,103.38 22.1,54.86 0.76,54.86
  pour Bottom (isolate 0.305): 0.76,103.38 22.1,103.38 22.1,54.86
N$1
  Top 0.254: D1.C 27.76,17.25 R6.2
N$2
  Top 0.254: U$4.10 36.07,79.25 36.83,80.01 36.83,94.39 35.56,95.66 33.27,95.66 33.13,95.8 33.06,95.83 32.24,96.65 C9.1
N$3
  Top 0.254: R5.2 27.66,96.62 C9.2
N$4
  Top 0.254: C10.1 34.95,88.01 36.32,86.64 36.32,82.53 35.64,81.84 34.72,81.84 U$4.12
N$5
  Top 0.406: U$7.1 U$7.2 9,30.88 8.51,31.37 8.51,36.58 8.26,36.83 7.29,36.83 U$6.1 3.73,36.88 C13.1
N$6
  Top 0.254: R8.1 7.07,34.8 U$6.3
PA00
  Top 0.254: U$1.1 14.92,12.52 16.13,11.3 16.13,7.11 15.88,6.86 11.24,6.86 GPIO_HDR.6
PA01
  Top 0.254: U$1.2 15.72,12.48 16.64,11.56 16.64,6.86 16.13,6.35 13.27,6.35 GPIO_HDR.5
PA02
  Top 0.254: U$1.3 16.52,12.44 17.14,11.81 17.14,6.48 16.51,5.84 15.3,5.84 GPIO_HDR.4
PA03
  Top 0.254: U$1.4 17.32,12.4 17.65,12.06 17.65,5.65 GPIO_HDR.3
PA04
  Top 0.254: U$1.5 18.12,3.79 GPIO_HDR.2
PA05
  Top 0.254: U$1.6 18.92,12.31 18.67,12.06 18.67,5.78 GPIO_HDR.1
PA22
  Top 0.254: U$1.21 17.32,22.05 16.13,23.24 15.24,23.24 13.84,24.64 13.84,35.31 16.26,37.72 I2C_HDR.1
PA23
  Top 0.254: U$1.22 16.52,22.09 15.88,22.73 14.99,22.73 13.21,24.51 13.21,35.56 I2C_HDR.2
PA24
  Top 0.254: U$1.23 15.72,21.88 15.37,22.23 14.73,22.23 12.7,24.26 12.7,39.37 JTAG_HDR.2
PA25
  Top 0.254: U$1.24 14.82,21.37 12.19,24 12.19,37.34 JTAG_HDR.3
PA27  (via drill 0.7)
  Top 0.254: U$1.25 17.01,20.07 v20.07,17.02 | v23.88,14.22 26.01,14.22 D1.A
  Bottom 0.254: v20.07,17.02 21.08,17.02 v23.88,14.22
PIR_TRIG
  Top 0.254: U$1.7 19.72,12.35 19.18,11.81 19.18,6.86 20.19,5.84 21.91,5.84 PIR_HDR.3
PIR_VCC
  Top 0.406: PIR_HDR.1 29.15,6.71 T3.3
PIR_VCC_CTL  (via drill 0.7)
  Top 0.254: U$1.8 20.52,10.47 v21.59,9.4 | v33.27,17.14 34.56,17.14 T3.1
  Bottom 0.254: v21.59,9.4 25.53,9.4 v33.27,17.14
RF
  Top 1.016: U$2.23 U$3.5
SWCLK
  Top 0.254: U$1.31 12.99,15.27 12.57,14.86 12.57,10.96 R1.1 11.24,8.32 9.65,6.73 7.62,6.73 7.62,7.62 U$5.4
SWDIO  (via drill 0.7)
  Top 0.254: U$1.32 13.62,8.79 v12.95,8.13
  Bottom 0.254: v12.95,8.13 8.38,8.13 U$5.2
VCC  (via drill 0.7)
  Top 0.406: C1.1 C2.1 8.06,22.86 v11.18,22.86 11.43,23.11 11.43,31.11 9.91,32.63 R8.2 10.79,33.62 10.79,35.56 9.55,36.81 U$6.5 9.55,37.44 JTAG_HDR.4 | v18.67,14.73 17.33,16.07 U$1.30 12.9,16.07 11.18,14.35 11.18,12.53 R1.2 8.42,9.65 U$5.1 | v28.07,7.75 28.07,9.56 L2.2 28.3,9.63 29.46,10.79 29.46,16.61 T3.2 30.86,18.27 v30.86,20.07 | v30.23,25.78 28.92,25.78 T2.2 26.39,25.55 25.15,26.8 23.11,26.8 21.84,25.53 20.21,25.53 T1.2 | v7.11,43.69 8.53,43.69 R7.2
  Bottom 0.406: v28.07,7.75 27.3,6.99 21.72,6.99 18.67,10.03 v18.67,14.73 18.67,15.37 v11.18,22.86 | v30.86,20.07 30.86,25.15 v30.23,25.78 | v7.11,43.69 6.03,42.61 6.03,40.96 JTAG_HDR.4
VDDANA
  Top 0.406: L2.1 26.95,12.51 C7.1 C3.1 21.82,14.13 U$1.9
VDDCORE
  Top 0.406: U$1.27 11.06,18.47 L1.2 10.41,18.99 C4.1 C5.1
VSW
  Top 0.406: U$1.29 10.97,16.87 L1.1

### Text on the board
tPlace: INT | Grideye Breakout | SCL | Occulow | SDA | VCC | GND | GRIDEYE | RX | TX | CTS | RTS | GND | VCC | RST_N | Occulow | Control Board | LORA | GND | VCC | RX | TX | CTS | RTS | RST_N | PA22 | GND | VCC | INT | SCL | SAM L21E | SDA | GRIDEYE | PA03 | PA04 | PA05 | TRIG | GND | VCC | PA00 | PA01 | PA02 | PIR